# Altium project cs_consolidated.PrjPcb (part 2 of 3)

## Sheet source_A.SchDoc
size 381 x 241 mm; SheetNumber: 4; SheetTotal: 6
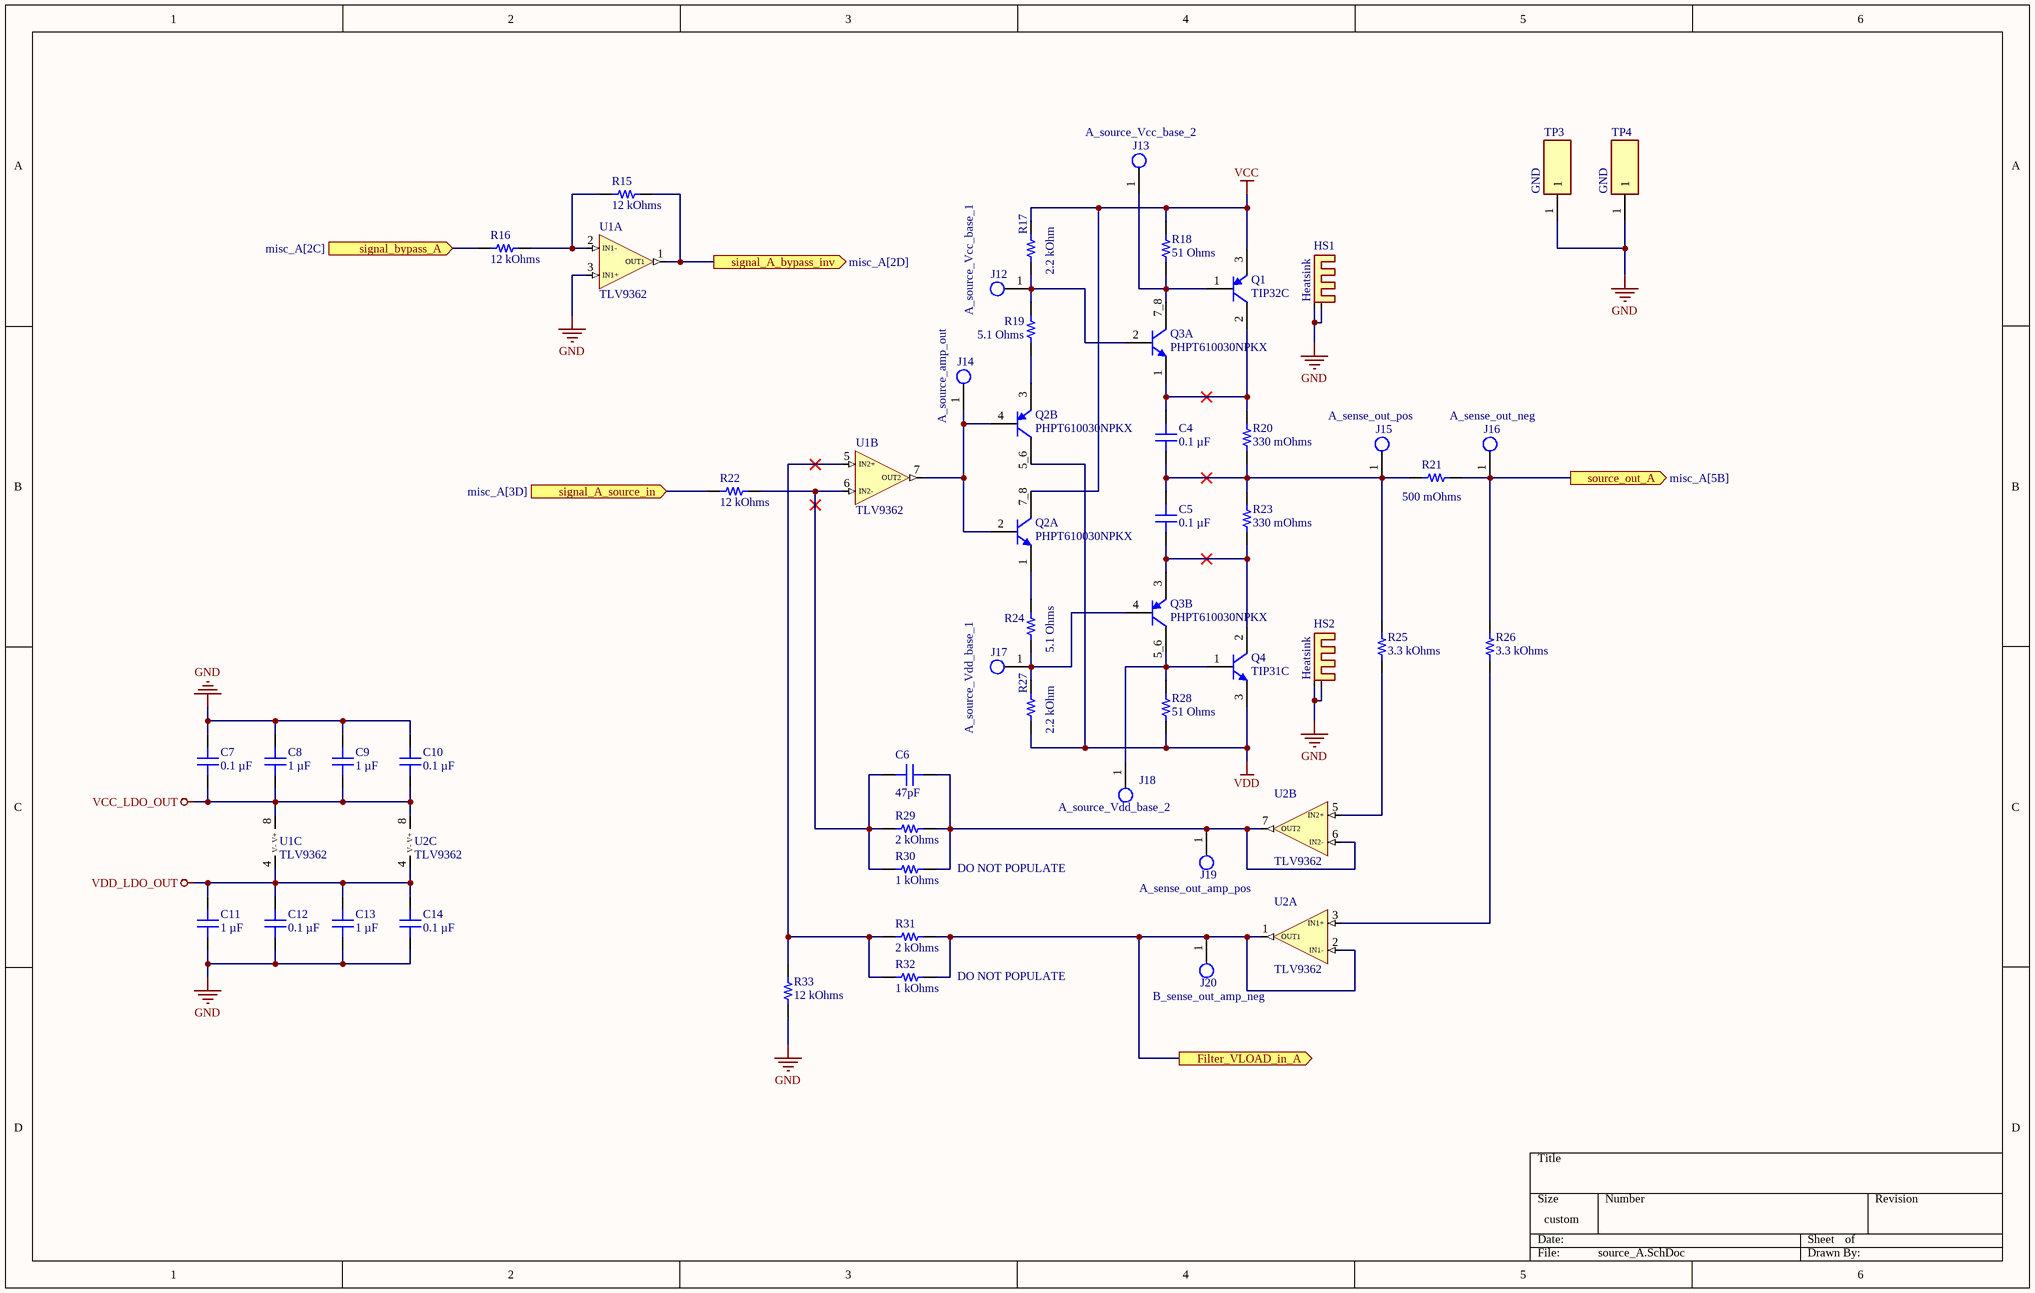
[diagram p3: source_A.SchDoc]

### Parts
C4  0.1 µF  [CAP 1206_3216 - 0.8MM]
C5  0.1 µF  [CAP 1206_3216 - 0.8MM]
C6  47pF  [CAP 1206_3216 - 1.8MM]
C7  0.1 µF  [CAP 1206_3216 - 0.8MM]
C8  1 µF  [CAP 1206_3216 - 0.8MM]
C9  1 µF  [CAP 1206_3216 - 0.8MM]
C10  0.1 µF  [CAP 1206_3216 - 0.8MM]
C11  1 µF  [CAP 1206_3216 - 0.8MM]
C12  0.1 µF  [CAP 1206_3216 - 0.8MM]
C13  1 µF  [CAP 1206_3216 - 0.8MM]
C14  0.1 µF  [CAP 1206_3216 - 0.8MM]
HS1  Heatsink  [593002B03400G]
HS2  Heatsink  [593002B03400G]
J12  A_source_Vcc_base_1  [FP-5001-MFG]
J13  A_source_Vcc_base_2  [FP-5001-MFG]
J14  A_source_amp_out  [FP-5001-MFG]
J15  A_sense_out_pos  [FP-5001-MFG]
J16  A_sense_out_neg  [FP-5001-MFG]
J17  A_source_Vdd_base_1  [FP-5001-MFG]
J18  A_source_Vdd_base_2  [FP-5001-MFG]
J19  A_sense_out_amp_pos  [FP-5001-MFG]
J20  B_sense_out_amp_neg  [FP-5001-MFG]
Q1  TIP32C  [ONSC-TO-220-3-221A-09]
Q2  PHPT610030NPKX  [TRANS_BUK9K18-40E,115]  (parts A,B of 2)
Q3  PHPT610030NPKX  [TRANS_BUK9K18-40E,115]  (parts A,B of 2)
Q4  TIP31C  [ONSC-TO-220-3-221A-09]
R15  12 kOhms  [RES 1206_3216]
R16  12 kOhms  [RES 1206_3216]
R17  2.2 kOhm  [RESC3116X65N]
R18  51 Ohms  [RES 1206_3216]
R19  5.1 Ohms  [RES 1206_3216]
R20  330 mOhms  [STACKPOLE CSR2512]
R21  500 mOhms  [STACKPOLE CSR2512]
R22  12 kOhms  [RES 1206_3216]
R23  330 mOhms  [STACKPOLE CSR2512]
R24  5.1 Ohms  [RES 1206_3216]
R25  3.3 kOhms  [YAGEO RES 1206_3216]
R26  3.3 kOhms  [YAGEO RES 1206_3216]
R27  2.2 kOhm  [RESC3116X65N]
R28  51 Ohms  [RES 1206_3216]
R29  2 kOhms  [RES 1206_3216]
R30  1 kOhms  [RES 1206_3216]
R31  2 kOhms  [RES 1206_3216]
R32  1 kOhms  [RES 1206_3216]
R33  12 kOhms  [RES 1206_3216]
TP3  GND  [S175146R]
TP4  GND  [S175146R]
U1  TLV9362  [SOIC8-127P600X175-8N]  (parts A,B,C of 3)
U2  TLV9362  [SOIC8-127P600X175-8N]  (parts A,B,C of 3)

### Ports
Filter_VLOAD_in_A (out), signal_A_bypass_inv (out, see misc_A[2D]), signal_A_source_in (in, see misc_A[3D]), signal_bypass_A (in, see misc_A[2C]), source_out_A (out, see misc_A[5B])

### Nets
GND: C7.1 C8.1 C9.2 C10.2 C11.2 C12.2 C13.2 C14.2 HS1.1 HS1.2 HS2.1 HS2.2 R33.1 TP3.1 TP4.1 U1.3(IN1+)
VCC: Q1.3(E) Q2.7_8(C1) R17.2 R18.2
VCC_LDO_OUT: C7.2 C8.2 C9.1 C10.1 U1.8(V+) U2.8(V+)
VDD: Q2.5_6(C2) Q4.3(E) R27.1 R28.1
VDD_LDO_OUT: C11.1 C12.1 C13.1 C14.1 U1.4(V-) U2.4(V-)
NetC4_1: C4.1 C5.2 J15.1 R20.1 R21.2 R23.2 R25.1
NetC4_2: C4.2 Q1.2(C) Q3.1(E1) R20.2
NetC5_1: C5.1 Q3.3(E2) Q4.2(C) R23.1
NetC6_1: C6.1 R22.1 R29.1 R30.1 U1.6(IN2-)
NetC6_2: C6.2 J19.1 R29.2 R30.2 U2.6(IN2-) U2.7(OUT2)
NetD1_2: J16.1 R21.1 R26.1 ; port source_out_A
NetD2_1: R16.2 ; port signal_bypass_A
NetJ10_1: R22.2 ; port signal_A_source_in
NetJ11_5: R15.2 U1.1(OUT1) ; port signal_A_bypass_inv
NetJ12_1: J12.1 Q3.2(B1) R17.1 R19.2
NetJ13_1: J13.1 Q1.1(B) Q3.7_8(C1) R18.1
NetJ14_1: J14.1 Q2.2(B1) Q2.4(B2) U1.7(OUT2)
NetJ17_1: J17.1 Q3.4(B2) R24.1 R27.2
NetJ18_1: J18.1 Q3.5_6(C2) Q4.1(B) R28.2
NetJ20_1: J20.1 R31.2 R32.2 U2.1(OUT1) U2.2(IN1-) ; port Filter_VLOAD_in_A
NetQ2_1: Q2.1(E1) R24.2
NetQ2_3: Q2.3(E2) R19.1
NetR15_1: R15.1 R16.1 U1.2(IN1-)
NetR25_2: R25.2 U2.5(IN2+)
NetR26_2: R26.2 U2.3(IN1+)
NetR31_1: R31.1 R32.1 R33.2 U1.5(IN2+)

### Notes on the sheet
- DO NOT POPULATE

### Library data of the parts
C4 C5 C7 C10 C12 C14 = 885012208087: CAP CER 0.1UF 50V X7R 1206; manufacturer: Würth Elektronik; Tolerance: ±10%; Part Number: 885012208087; Capacitance: 0.1 µF; Applications: General Purpose; componentlink1description: Datasheet; componentlink1url: https://katalog.we-online.de/pbs/datasheet/885012208087.pdf; componentlink2description: DigiKey Link; componentlink2url: https://www.digikey.com/en/products/detail/würth-elektronik/885012208087/5453982; Device Package: 1206 (3216 Metric); lastupdated: 6/4/2024 19:10:27; Lifecycle Status: Active; Minimum Order: 1; Mounting Type: Surface Mount, MLCC; Operating Temperature: -55°C ~ 125°C; Package / Case: 1206 (3216 Metric); packaging: TapeAndReel; partid: 20879; Part Status: Active; price: 0.06; series: WCAP-CSGP; Size / Dimension: 0.126" L x 0.063" W (3.20mm x 1.60mm); Supplier 1: DigiKey; Supplier Part Number 1: 732-8127-1-ND; Temperature Coefficient: X7R; Thickness (Max): 0.035" (0.90mm); value: 0.1 µF; Voltage - Rated: 50V
C6 = 1206AA470KAT1A: CAP CER 47PF 1KV C0G/NP0 1206; manufacturer: AVX Corporation; Temperature Coefficient: C0G, NP0; Tolerance: ±10%; Voltage - Rated: 1000V (1kV); Part Number: 1206AA470KAT1A; Capacitance: 47pF; Applications: General Purpose; componentlink1description: Datasheet; componentlink1url: http://datasheets.avx.com/AVX-HV_MLCC.pdf; componentlink2description: DigiKey Link; componentlink2url: http://digikey.com/product-detail/en/avx-corporation/1206AA470KAT1A/478-2949-1-ND/808148; Device Package: 1206 (3216 Metric); Features: High Voltage; lastupdated: 9/2/2020 01:05:31; Lifecycle Status: Active; Minimum Order: 1; Mounting Type: Surface Mount, MLCC; Operating Temperature: -55°C ~ 125°C; Package / Case: 1206 (3216 Metric); packaging: TapeAndReel; partid: 21825; Part Status: Active; price: 0.11; series: -; Size / Dimension: 0.130" L x 0.063" W (3.30mm x 1.60mm); Supplier 1: DigiKey; Supplier Part Number 1: 478-2949-1-ND; Thickness (Max): 0.071" (1.80mm); value: 47pF
C8 C9 C11 C13 = 885012208093: CAP CER 1UF 50V X7R 1206; manufacturer: Würth Elektronik; Tolerance: ±10%; Part Number: 885012208093; Capacitance: 1 µF; Applications: General Purpose; componentlink1description: Datasheet; componentlink1url: https://katalog.we-online.de/pbs/datasheet/885012208093.pdf; componentlink2description: DigiKey Link; componentlink2url: https://www.digikey.com/en/products/detail/würth-elektronik/885012208093/5453432; Device Package: 1206 (3216 Metric); lastupdated: 6/4/2024 19:10:33; Lifecycle Status: Active; Minimum Order: 1; Mounting Type: Surface Mount, MLCC; Operating Temperature: -55°C ~ 125°C; Package / Case: 1206 (3216 Metric); packaging: TapeAndReel; partid: 39665; Part Status: Active; price: 0.10; series: WCAP-CSGP; Size / Dimension: 0.126" L x 0.063" W (3.20mm x 1.60mm); Supplier 1: DigiKey; Supplier Part Number 1: 732-7577-1-ND; Temperature Coefficient: X7R; Thickness (Max): 0.075" (1.90mm); value: 1 µF; Voltage - Rated: 50V
HS1 HS2 = 593002B03400G: 593002B03400G Heatsink TO220 13.4 C/W; Manufacturer_Name: Aavid Thermalloy; Datasheet Link: 3dofAavidThermalloy593002B03400G; Height: 29.97mm; Manufacturer_Part_Number: 593002B03400G; Mouser Part Number: 532-593002B03400G; Mouser Price/Stock: https://www.mouser.co.uk/ProductDetail/Aavid/593002B03400G?qs=W5RTpZXIxnNcIJ9LzCiOiQ%3D%3D; Arrow Part Number: 593002B03400G; Arrow Price/Stock: https://www.arrow.com/en/products/593002b03400g/aavid-thermalloy
J12-J20 = 5001: PC TEST POINT MINIATURE BLACK; Body Material: Bronze; Plating: Silver; Inside Diameter: 1.27mm; Hole Diameter: 1.6mm; Number of Ports: 1; Outside Diameter: 2.54mm; Insulation: Insulated; Insulation Material: Nylon; Mount: Through Hole; RoHS Compliant: Yes; Series: THM; Height: 0.3inch; Termination: Through Hole; Material: Nylon; Packaging: Bulk; Contact Material: Bronze; REACH SVHC: No SVHC; Contact Plating: Silver; Orientation: Straight; Lead Free: Lead Free; Package Quantity: 100; Length: 7.62mm; Flammability Rating: UL94 V-0; Number of Contacts: 1; Diameter: 2.54mm; Housing Color: Black; Color: Black; Supplier 1: Mouser; Supplier Part Number 1: 534-5001
Q1 = TIP32C: Complementary Silicon Plastic Power Transistor, 3-Pin TO-220, Tube; Manufacturer: On Semiconductor; fT Min (MHz): 3; Polarity: PNP; DatasheetVersion: Rev. 14; PackageVersion: Rev. AG, 09/2011; PackageReference: TO-220-3-221A-09; PackageDescription: 3-Pin Flange Mount, Vertical Straight Lead, Body 9.97 x 4.445 mm, Pitch 2.54 mm; Supplier 1: Digi-Key; Supplier Part Number 1: TIP32COS-ND; IC Continuous (A): 3; Packing: Tube; RoHS: FALSE; Mounting Technology: Through Hole; PartNumber: TIP32C; ComponentLink1Description: Manufacturer URL; ComponentLink1URL: http://www.onsemi.com/; ComponentLink2Description: Datasheet; ComponentLink2URL: http://www.onsemi.com/pub_link/Collateral/TIP31A-D.PDF; ComponentLink3Description: Package Specification; ComponentLink3URL: http://www.onsemi.com/pub_link/Collateral/221A-09.PDF
Q2 Q3 = PHPT610030NPK: ComponentLink1Description: Datasheet; ComponentLink1URL: https://assets.nexperia.com/documents/data-sheet/PHPT610030NPK.pdf; ComponentLink2Description: Supplier; ComponentLink2URL: https://hr.mouser.com/ProductDetail/Nexperia/PHPT610030NPKX?qs=%252BRKXB2WKlSeoXKhT5DAScw%3D%3D
Q4 = TIP31C: Complementary Silicon Plastic Power Transistor, 3-Pin TO-220, Tube; Manufacturer: On Semiconductor; fT Min (MHz): 3; Polarity: NPN; DatasheetVersion: Rev. 14; PackageVersion: Rev. AG, 09/2011; PackageReference: TO-220-3-221A-09; PackageDescription: 3-Pin Flange Mount, Vertical Straight Lead, Body 9.97 x 4.445 mm, Pitch 2.54 mm; Supplier 1: Digi-Key; Supplier Part Number 1: TIP31COS-ND; IC Continuous (A): 3; Packing: Tube; RoHS: FALSE; Mounting Technology: Through Hole; PartNumber: TIP31C; ComponentLink1Description: Manufacturer URL; ComponentLink1URL: http://www.onsemi.com/; ComponentLink2Description: Datasheet; ComponentLink2URL: http://www.onsemi.com/pub_link/Collateral/TIP31A-D.PDF; ComponentLink3Description: Package Specification; ComponentLink3URL: http://www.onsemi.com/pub_link/Collateral/221A-09.PDF
R15 R16 R22 R33 = ERA-8AEB123V: RES SMD 12K OHM 0.1% 1/4W 1206; Manufacturer: Panasonic Electronic Components; Power (Watts): 0.25W, 1/4W; Temperature Coefficient: ±25ppm/°C; Part Number: ERA-8AEB123V; ComponentLink1Description: Datasheet; ComponentLink1URL: https://industrial.panasonic.com/cdbs/www-data/pdf/RDM0000/AOA0000C307.pdf; ComponentLink2Description: DigiKey Link; ComponentLink2URL: https://www.digikey.com/en/products/detail/panasonic-electronic-components/ERA-8AEB123V/3070775; Composition: Thin Film; Device Package: 1206 (3216 Metric); Height - Seated (Max): 0.028" (0.70mm); LastUpdated: 2/9/2024 20:53:53; Lifecycle Status: Active; Minimum Order: 1; Number of Terminations: 2; Operating Temperature: -55°C ~ 155°C; Package / Case: 1206 (3216 Metric); Packaging: TapeAndReel; PartId: 40988; Part Status: Active; Price: 0.10; Resistance: 12 kOhms; Series: ERA-8A; Size / Dimension: 0.126" L x 0.063" W (3.20mm x 1.60mm); Supplier 1: DigiKey; Supplier Part Number 1: 10-ERA-8AEB123VCT-ND; Supplier Device Package: 1206; Tolerance: ±0.1%; Value: 12 kOhms; Features: Automotive AEC-Q200; Ratings: AEC-Q200
R17 R27 = RT1206FRE072K2L: Resistor; Manufacturer_Name: YAGEO; Datasheet Link: https://www.mouser.com/datasheet/2/447/PYu_RT_1_to_0_01_RoHS_L_12-3003070.pdf; Height: 0.65mm; Manufacturer_Part_Number: RT1206FRE072K2L; Mouser Part Number: 603-RT1206FRE072K2L; Mouser Price/Stock: https://www.mouser.co.uk/ProductDetail/YAGEO/RT1206FRE072K2L?qs=yNCrj0CQcyJif6VASMbdeQ%3D%3D; Arrow Part Number: RT1206FRE072K2L; Arrow Price/Stock: https://www.arrow.com/en/products/rt1206fre072k2l/yageo?utm_currency=USD&region=nac
R18 R28 = ERJ-8GEYJ510V: RES SMD 51 OHM 5% 1/4W 1206; Manufacturer: Panasonic Electronic Components; Power (Watts): 0.25W, 1/4W; Temperature Coefficient: ±200ppm/°C; Part Number: ERJ-8GEYJ510V; ComponentLink1Description: Datasheet; ComponentLink1URL: http://industrial.panasonic.com/www-cgi/jvcr13pz.cgi?E+PZ+3+AOA0001+ERJ8GEYJ510V+7+WW; ComponentLink2Description: DigiKey Link; ComponentLink2URL: https://www.digikey.com/en/products/detail/panasonic-electronic-components/ERJ-8GEYJ510V/11678; Composition: Thick Film; Device Package: 1206 (3216 Metric); Features: Automotive AEC-Q200; Height - Seated (Max): 0.028" (0.70mm); LastUpdated: 2/9/2024 20:54:16; Lifecycle Status: Active; Minimum Order: 1; Number of Terminations: 2; Operating Temperature: -55°C ~ 155°C; Package / Case: 1206 (3216 Metric); Packaging: TapeAndReel; PartId: 34147; Part Status: Active; Price: 0.02; Ratings: AEC-Q200; Resistance: 51 Ohms; Series: ERJ-8G; Size / Dimension: 0.126" L x 0.063" W (3.20mm x 1.60mm); Supplier 1: DigiKey; Supplier Part Number 1: P51ECT-ND; Supplier Device Package: 1206; Tolerance: ±5%; Value: 51 Ohms
R19 R24 = ERJ-8GEYJ5R1V: RES SMD 5.1 OHM 5% 1/4W 1206; Manufacturer: Panasonic Electronic Components; Power (Watts): 0.25W, 1/4W; Temperature Coefficient: -100/ +600ppm/°C; Part Number: ERJ-8GEYJ5R1V; ComponentLink1Description: Datasheet; ComponentLink1URL: http://industrial.panasonic.com/www-cgi/jvcr13pz.cgi?E+PZ+3+AOA0001+ERJ8GEYJ5R1V+7+WW; ComponentLink2Description: DigiKey Link; ComponentLink2URL: https://www.digikey.com/en/products/detail/panasonic-electronic-components/ERJ-8GEYJ5R1V/282211; Composition: Thick Film; Device Package: 1206 (3216 Metric); Features: Automotive AEC-Q200; Height - Seated (Max): 0.028" (0.70mm); LastUpdated: 2/9/2024 20:54:09; Lifecycle Status: Active; Minimum Order: 1; Number of Terminations: 2; Operating Temperature: -55°C ~ 155°C; Package / Case: 1206 (3216 Metric); Packaging: TapeAndReel; PartId: 36042; Part Status: Active; Price: 0.02; Ratings: AEC-Q200; Resistance: 5.1 Ohms; Series: ERJ-8G; Size / Dimension: 0.126" L x 0.063" W (3.20mm x 1.60mm); Supplier 1: DigiKey; Supplier Part Number 1: P5.1ECT-ND; Supplier Device Package: 1206; Tolerance: ±5%; Value: 5.1 Ohms
R20 R23 = CSRN2512FKR330: RES 0.33 OHM 1% 2W 2512; Manufacturer: Stackpole Electronics Inc; Temperature Coefficient: ±200ppm/°C; Part Number: CSRN2512FKR330; Package / Case: 2512 (6432 Metric); ComponentLink1Description: Datasheet; ComponentLink1URL: https://www.seielect.com/catalog/sei-csr_csrn.pdf; ComponentLink2Description: DigiKey Link; ComponentLink2URL: https://www.digikey.com/en/products/detail/stackpole-electronics-inc/CSRN2512FKR330/1742756; Composition: Thick Film; Device Package: 2512 (6432 Metric); Features: Current Sense; Height - Seated (Max): 0.028" (0.70mm); LastUpdated: 2/17/2022 18:43:57; Lifecycle Status: Active; Minimum Order: 1; Number of Terminations: 2; Operating Temperature: -55°C ~ 155°C; Packaging: TapeAndReel; PartId: 1770; Part Status: Active; Power (Watts): 2W; Price: 0.12; Resistance: 330 mOhms; Series: CSRN; Size / Dimension: 0.250" L x 0.124" W (6.35mm x 3.15mm); Supplier 1: DigiKey; Supplier Part Number 1: CSRN2512FKR330CT-ND; Supplier Device Package: 2512; Tolerance: ±1%; Value: 330 mOhms
R21 = CSRN2512FKR500: RES 0.5 OHM 1% 2W 2512; Manufacturer: Stackpole Electronics Inc; Temperature Coefficient: ±200ppm/°C; Part Number: CSRN2512FKR500; Package / Case: 2512 (6432 Metric); ComponentLink1Description: Datasheet; ComponentLink1URL: https://www.seielect.com/catalog/sei-csr_csrn.pdf; ComponentLink2Description: DigiKey Link; ComponentLink2URL: https://www.digikey.com/en/products/detail/stackpole-electronics-inc/CSRN2512FKR500/1742768; Composition: Thick Film; Device Package: 2512 (6432 Metric); Features: Current Sense; Height - Seated (Max): 0.028" (0.70mm); LastUpdated: 2/17/2022 18:43:58; Lifecycle Status: Active; Minimum Order: 1; Number of Terminations: 2; Operating Temperature: -55°C ~ 155°C; Packaging: TapeAndReel; PartId: 1683; Part Status: Active; Power (Watts): 2W; Price: 0.07; Resistance: 500 mOhms; Series: CSRN; Size / Dimension: 0.250" L x 0.124" W (6.35mm x 3.15mm); Supplier 1: DigiKey; Supplier Part Number 1: CSRN2512FKR500CT-ND; Supplier Device Package: 2512; Tolerance: ±1%; Value: 500 mOhms
R25 R26 = RT1206FRE073K3L: RES SMD 3.3K OHM 1% 1/4W 1206; Manufacturer: Yageo; Power (Watts): 0.25W, 1/4W; Temperature Coefficient: ±50ppm/°C; Part Number: RT1206FRE073K3L; ComponentLink1Description: Datasheet; ComponentLink1URL: https://www.yageo.com/upload/media/product/productsearch/datasheet/rchip/PYu-RT_1-to-0.01_RoHS_L_12.pdf; ComponentLink2Description: DigiKey Link; ComponentLink2URL: https://www.digikey.com/en/products/detail/yageo/RT1206FRE073K3L/1083187; Composition: Thin Film; Device Package: 1206 (3216 Metric); Height - Seated (Max): 0.026" (0.65mm); LastUpdated: 7/25/2024 09:21:22; Lifecycle Status: Active; Minimum Order: 1; Number of Terminations: 2; Operating Temperature: -55°C ~ 155°C; Package / Case: 1206 (3216 Metric); Packaging: TapeAndReel; PartId: 58380; Part Status: Active; Price: 0.01; Resistance: 3.3 kOhms; Series: RT; Size / Dimension: 0.122" L x 0.063" W (3.10mm x 1.60mm); Supplier 1: DigiKey; Supplier Part Number 1: 13-RT1206FRE073K3LCT-ND; Supplier Device Package: 1206; Tolerance: ±1%; Value: 3.3 kOhms
R29 R31 = ERA-8AEB202V: RES SMD 2K OHM 0.1% 1/4W 1206; Manufacturer: Panasonic Electronic Components; Power (Watts): 0.25W, 1/4W; Temperature Coefficient: ±25ppm/°C; Part Number: ERA-8AEB202V; ComponentLink1Description: Datasheet; ComponentLink1URL: https://industrial.panasonic.com/cdbs/www-data/pdf/RDM0000/AOA0000C307.pdf; ComponentLink2Description: DigiKey Link; ComponentLink2URL: https://www.digikey.com/en/products/detail/panasonic-electronic-components/ERA-8AEB202V/3070866; Composition: Thin Film; Device Package: 1206 (3216 Metric); Features: Automotive AEC-Q200; Height - Seated (Max): 0.028" (0.70mm); LastUpdated: 2/9/2024 20:54:17; Lifecycle Status: Active; Minimum Order: 1; Number of Terminations: 2; Operating Temperature: -55°C ~ 155°C; Package / Case: 1206 (3216 Metric); Packaging: TapeAndReel; PartId: 34011; Part Status: Active; Price: 0.10; Ratings: AEC-Q200; Resistance: 2 kOhms; Series: ERA-8A; Size / Dimension: 0.126" L x 0.063" W (3.20mm x 1.60mm); Supplier 1: DigiKey; Supplier Part Number 1: P2.0KBCCT-ND; Supplier Device Package: 1206; Tolerance: ±0.1%; Value: 2 kOhms
R30 R32 = ERA-8AEB102V: RES SMD 1K OHM 0.1% 1/4W 1206; Manufacturer: Panasonic Electronic Components; Power (Watts): 0.25W, 1/4W; Temperature Coefficient: ±25ppm/°C; Part Number: ERA-8AEB102V; ComponentLink1Description: Datasheet; ComponentLink1URL: https://industrial.panasonic.com/cdbs/www-data/pdf/RDM0000/AOA0000C307.pdf; ComponentLink2Description: DigiKey Link; ComponentLink2URL: https://www.digikey.com/en/products/detail/panasonic-electronic-components/ERA-8AEB102V/3070741; Composition: Thin Film; Device Package: 1206 (3216 Metric); Features: Automotive AEC-Q200; Height - Seated (Max): 0.028" (0.70mm); LastUpdated: 2/9/2024 20:54:17; Lifecycle Status: Active; Minimum Order: 1; Number of Terminations: 2; Operating Temperature: -55°C ~ 155°C; Package / Case: 1206 (3216 Metric); Packaging: TapeAndReel; PartId: 33986; Part Status: Active; Price: 0.10; Ratings: AEC-Q200; Resistance: 1 kOhms; Series: ERA-8A; Size / Dimension: 0.126" L x 0.063" W (3.20mm x 1.60mm); Supplier 1: DigiKey; Supplier Part Number 1: P1.0KBCCT-ND; Supplier Device Package: 1206; Tolerance: ±0.1%; Value: 1 kOhms
TP3 TP4 = S1751-46R: Test Point; Manufacturer_Name: Harwin; Datasheet Link: https://cdn.harwin.com/pdfs/S1751R.pdf; Height: 2mm; Manufacturer_Part_Number: S1751-46R; Mouser Part Number: 855-S1751-46R; Mouser Price/Stock: https://www.mouser.co.uk/ProductDetail/Harwin/S1751-46R?qs=l6ZPVqNVZb71wETAKrfRig%3D%3D
U1 U2 = TLV9362: TLV936x 10-MHz, 40-V, RRO, Operational Amplifie; ComponentLink1Description: Datasheet; ComponentLink1URL: https://www.ti.com/lit/ds/symlink/tlv9362.pdf

## Sheet source_B.SchDoc
size 381 x 241 mm; SheetNumber: 5; SheetTotal: 6
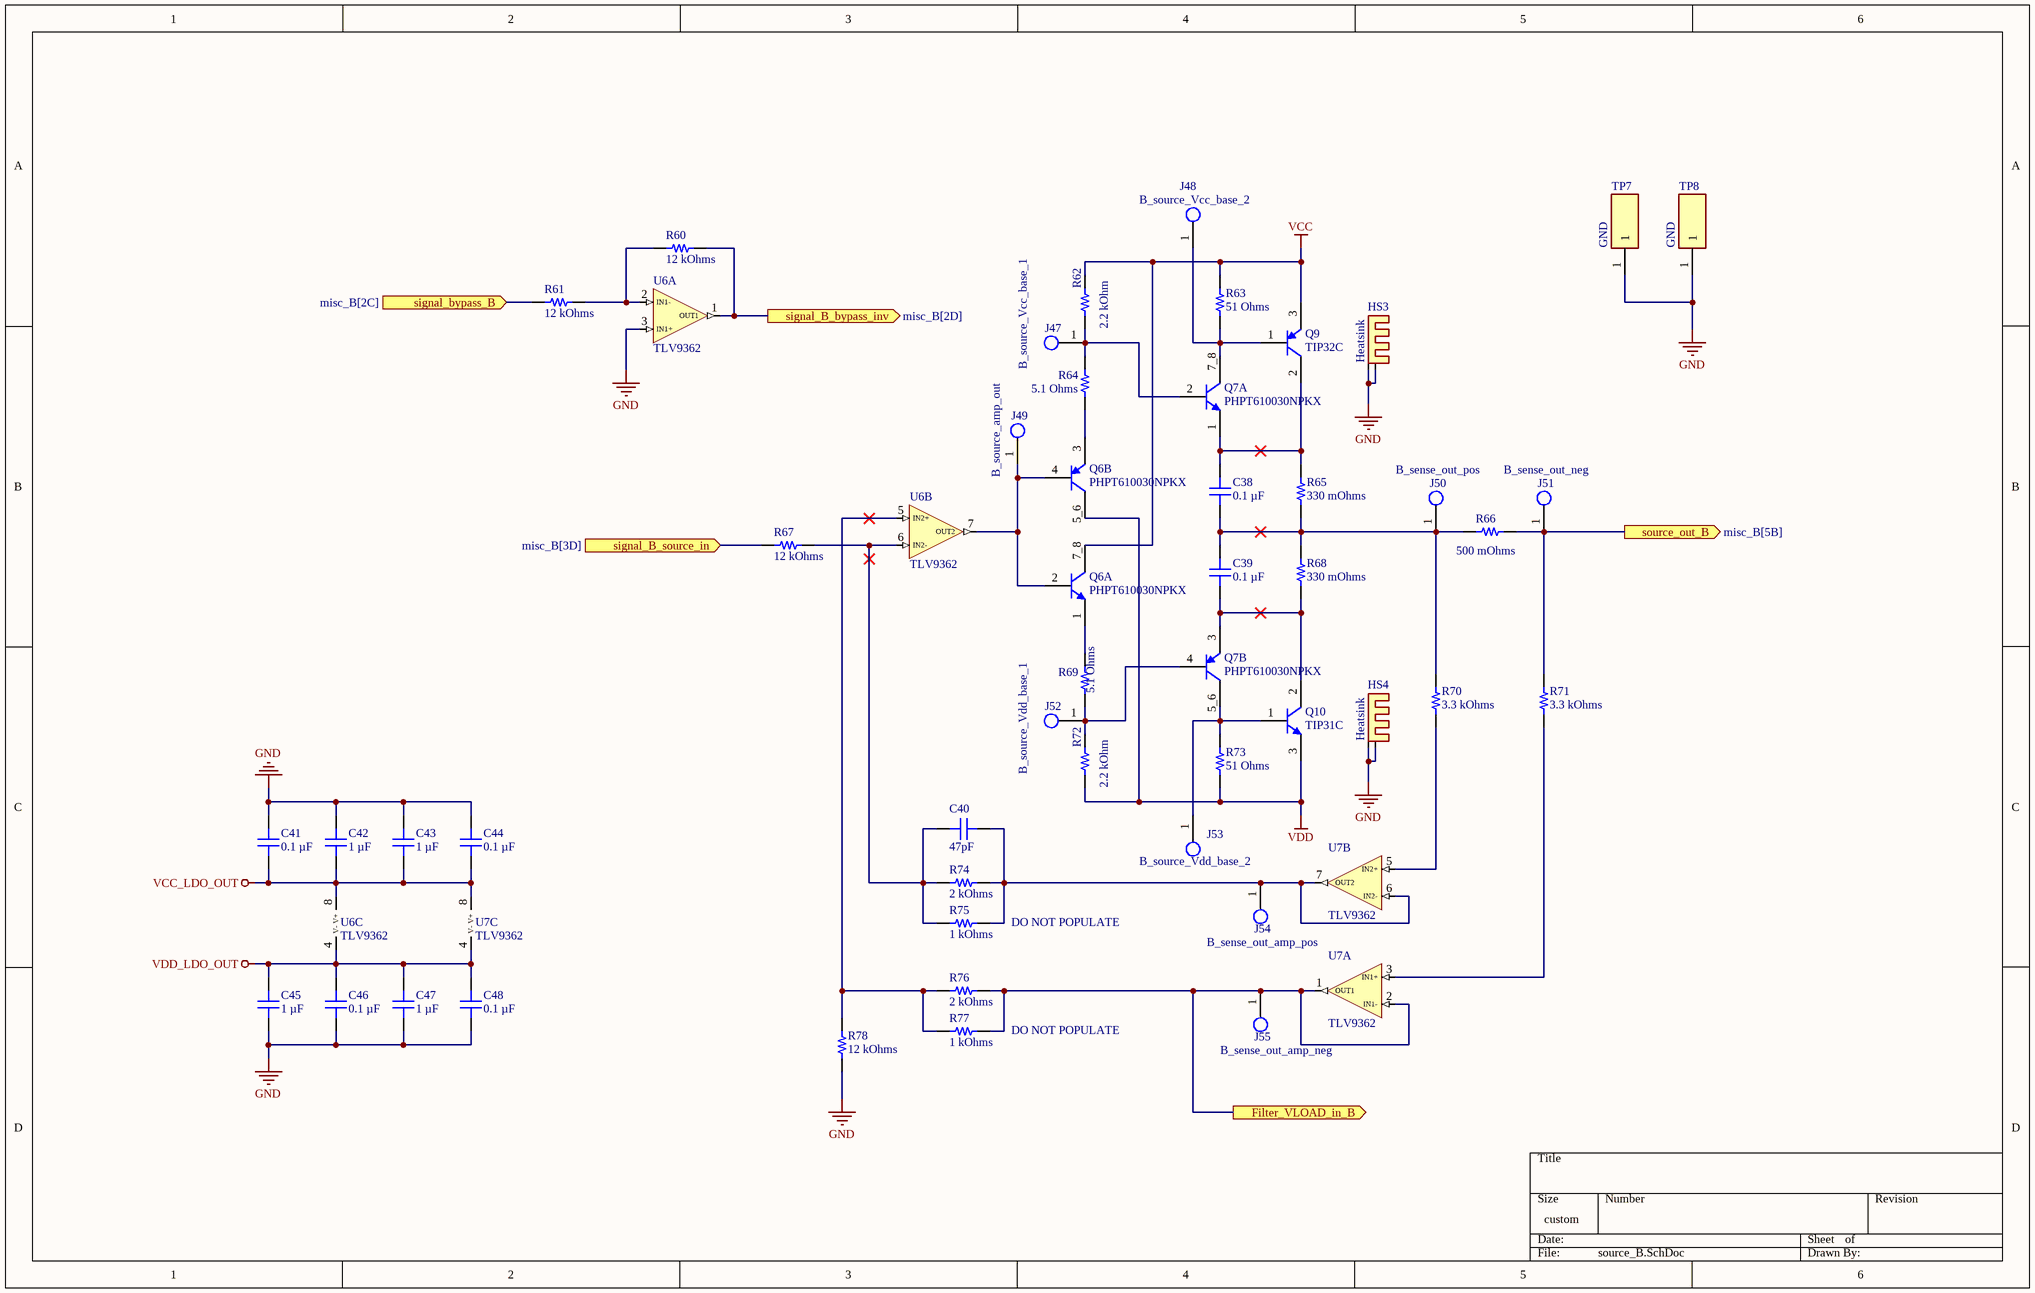
[diagram p4: source_B.SchDoc]

### Parts
C38  0.1 µF  [CAP 1206_3216 - 0.8MM]
C39  0.1 µF  [CAP 1206_3216 - 0.8MM]
C40  47pF  [CAP 1206_3216 - 1.8MM]
C41  0.1 µF  [CAP 1206_3216 - 0.8MM]
C42  1 µF  [CAP 1206_3216 - 0.8MM]
C43  1 µF  [CAP 1206_3216 - 0.8MM]
C44  0.1 µF  [CAP 1206_3216 - 0.8MM]
C45  1 µF  [CAP 1206_3216 - 0.8MM]
C46  0.1 µF  [CAP 1206_3216 - 0.8MM]
C47  1 µF  [CAP 1206_3216 - 0.8MM]
C48  0.1 µF  [CAP 1206_3216 - 0.8MM]
HS3  Heatsink  [593002B03400G]
HS4  Heatsink  [593002B03400G]
J47  B_source_Vcc_base_1  [FP-5001-MFG]
J48  B_source_Vcc_base_2  [FP-5001-MFG]
J49  B_source_amp_out  [FP-5001-MFG]
J50  B_sense_out_pos  [FP-5001-MFG]
J51  B_sense_out_neg  [FP-5001-MFG]
J52  B_source_Vdd_base_1  [FP-5001-MFG]
J53  B_source_Vdd_base_2  [FP-5001-MFG]
J54  B_sense_out_amp_pos  [FP-5001-MFG]
J55  B_sense_out_amp_neg  [FP-5001-MFG]
Q6  PHPT610030NPKX  [TRANS_BUK9K18-40E,115]  (parts A,B of 2)
Q7  PHPT610030NPKX  [TRANS_BUK9K18-40E,115]  (parts A,B of 2)
Q9  TIP32C  [ONSC-TO-220-3-221A-09]
Q10  TIP31C  [ONSC-TO-220-3-221A-09]
R60  12 kOhms  [RES 1206_3216]
R61  12 kOhms  [RES 1206_3216]
R62  2.2 kOhm  [RESC3116X65N]
R63  51 Ohms  [RES 1206_3216]
R64  5.1 Ohms  [RES 1206_3216]
R65  330 mOhms  [STACKPOLE CSR2512]
R66  500 mOhms  [STACKPOLE CSR2512]
R67  12 kOhms  [RES 1206_3216]
R68  330 mOhms  [STACKPOLE CSR2512]
R69  5.1 Ohms  [RES 1206_3216]
R70  3.3 kOhms  [YAGEO RES 1206_3216]
R71  3.3 kOhms  [YAGEO RES 1206_3216]
R72  2.2 kOhm  [RESC3116X65N]
R73  51 Ohms  [RES 1206_3216]
R74  2 kOhms  [RES 1206_3216]
R75  1 kOhms  [RES 1206_3216]
R76  2 kOhms  [RES 1206_3216]
R77  1 kOhms  [RES 1206_3216]
R78  12 kOhms  [RES 1206_3216]
TP7  GND  [S175146R]
TP8  GND  [S175146R]
U6  TLV9362  [SOIC8-127P600X175-8N]  (parts A,B,C of 3)
U7  TLV9362  [SOIC8-127P600X175-8N]  (parts A,B,C of 3)

### Ports
Filter_VLOAD_in_B (out), signal_B_bypass_inv (out, see misc_B[2D]), signal_B_source_in (in, see misc_B[3D]), signal_bypass_B (in, see misc_B[2C]), source_out_B (out, see misc_B[5B])

### Nets
GND: C41.1 C42.1 C43.2 C44.2 C45.2 C46.2 C47.2 C48.2 HS3.1 HS3.2 HS4.1 HS4.2 R78.1 TP7.1 TP8.1 U6.3(IN1+)
VCC: Q6.7_8(C1) Q9.3(E) R62.2 R63.2
VCC_LDO_OUT: C41.2 C42.2 C43.1 C44.1 U6.8(V+) U7.8(V+)
VDD: Q6.5_6(C2) Q10.3(E) R72.1 R73.1
VDD_LDO_OUT: C45.1 C46.1 C47.1 C48.1 U6.4(V-) U7.4(V-)
NetC38_1: C38.1 C39.2 J50.1 R65.1 R66.2 R68.2 R70.1
NetC38_2: C38.2 Q7.1(E1) Q9.2(C) R65.2
NetC39_1: C39.1 Q7.3(E2) Q10.2(C) R68.1
NetC40_1: C40.1 R67.1 R74.1 R75.1 U6.6(IN2-)
NetC40_2: C40.2 J54.1 R74.2 R75.2 U7.6(IN2-) U7.7(OUT2)
NetD5_2: J51.1 R66.1 R71.1 ; port source_out_B
NetD6_1: R61.2 ; port signal_bypass_B
NetJ45_1: R67.2 ; port signal_B_source_in
NetJ46_5: R60.2 U6.1(OUT1) ; port signal_B_bypass_inv
NetJ47_1: J47.1 Q7.2(B1) R62.1 R64.2
NetJ48_1: J48.1 Q7.7_8(C1) Q9.1(B) R63.1
NetJ49_1: J49.1 Q6.2(B1) Q6.4(B2) U6.7(OUT2)
NetJ52_1: J52.1 Q7.4(B2) R69.1 R72.2
NetJ53_1: J53.1 Q7.5_6(C2) Q10.1(B) R73.2
NetJ55_1: J55.1 R76.2 R77.2 U7.1(OUT1) U7.2(IN1-) ; port Filter_VLOAD_in_B
NetQ6_1: Q6.1(E1) R69.2
NetQ6_3: Q6.3(E2) R64.1
NetR60_1: R60.1 R61.1 U6.2(IN1-)
NetR70_2: R70.2 U7.5(IN2+)
NetR71_2: R71.2 U7.3(IN1+)
NetR76_1: R76.1 R77.1 R78.2 U6.5(IN2+)

### Notes on the sheet
- DO NOT POPULATE

### Library data of the parts
C38 C39 C41 C44 C46 C48 = 885012208087: as C4 on sheet source_A; Part Number: 885012208087; Capacitance: 0.1 µF; Applications: General Purpose; componentlink1description: Datasheet; componentlink1url: https://katalog.we-online.de/pbs/datasheet/885012208087.pdf; componentlink2description: DigiKey Link; componentlink2url: https://www.digikey.com/en/products/detail/würth-elektronik/885012208087/5453982; Device Package: 1206 (3216 Metric); lastupdated: 6/4/2024 19:10:27; Lifecycle Status: Active; Minimum Order: 1; Mounting Type: Surface Mount, MLCC; Operating Temperature: -55°C ~ 125°C; Package / Case: 1206 (3216 Metric); packaging: TapeAndReel; partid: 20879; Part Status: Active; price: 0.06; series: WCAP-CSGP; Size / Dimension: 0.126" L x 0.063" W (3.20mm x 1.60mm); Supplier 1: DigiKey; Supplier Part Number 1: 732-8127-1-ND; Temperature Coefficient: X7R; Thickness (Max): 0.035" (0.90mm); value: 0.1 µF; Voltage - Rated: 50V
C40 = 1206AA470KAT1A: as C6 on sheet source_A; Part Number: 1206AA470KAT1A; Capacitance: 47pF; Applications: General Purpose; componentlink1description: Datasheet; componentlink1url: http://datasheets.avx.com/AVX-HV_MLCC.pdf; componentlink2description: DigiKey Link; componentlink2url: http://digikey.com/product-detail/en/avx-corporation/1206AA470KAT1A/478-2949-1-ND/808148; Device Package: 1206 (3216 Metric); Features: High Voltage; lastupdated: 9/2/2020 01:05:31; Lifecycle Status: Active; Minimum Order: 1; Mounting Type: Surface Mount, MLCC; Operating Temperature: -55°C ~ 125°C; Package / Case: 1206 (3216 Metric); packaging: TapeAndReel; partid: 21825; Part Status: Active; price: 0.11; series: -; Size / Dimension: 0.130" L x 0.063" W (3.30mm x 1.60mm); Supplier 1: DigiKey; Supplier Part Number 1: 478-2949-1-ND; Thickness (Max): 0.071" (1.80mm); value: 47pF
C42 C43 C45 C47 = 885012208093: as C8 on sheet source_A; Part Number: 885012208093; Capacitance: 1 µF; Applications: General Purpose; componentlink1description: Datasheet; componentlink1url: https://katalog.we-online.de/pbs/datasheet/885012208093.pdf; componentlink2description: DigiKey Link; componentlink2url: https://www.digikey.com/en/products/detail/würth-elektronik/885012208093/5453432; Device Package: 1206 (3216 Metric); lastupdated: 6/4/2024 19:10:33; Lifecycle Status: Active; Minimum Order: 1; Mounting Type: Surface Mount, MLCC; Operating Temperature: -55°C ~ 125°C; Package / Case: 1206 (3216 Metric); packaging: TapeAndReel; partid: 39665; Part Status: Active; price: 0.10; series: WCAP-CSGP; Size / Dimension: 0.126" L x 0.063" W (3.20mm x 1.60mm); Supplier 1: DigiKey; Supplier Part Number 1: 732-7577-1-ND; Temperature Coefficient: X7R; Thickness (Max): 0.075" (1.90mm); value: 1 µF; Voltage - Rated: 50V
HS3 HS4 = 593002B03400G: as HS1 on sheet source_A; Datasheet Link: 3dofAavidThermalloy593002B03400G; Height: 29.97mm; Manufacturer_Part_Number: 593002B03400G; Mouser Part Number: 532-593002B03400G; Mouser Price/Stock: https://www.mouser.co.uk/ProductDetail/Aavid/593002B03400G?qs=W5RTpZXIxnNcIJ9LzCiOiQ%3D%3D; Arrow Part Number: 593002B03400G; Arrow Price/Stock: https://www.arrow.com/en/products/593002b03400g/aavid-thermalloy
J47-J55 = 5001: as J12 on sheet source_A; Insulation Material: Nylon; Mount: Through Hole; RoHS Compliant: Yes; Series: THM; Height: 0.3inch; Termination: Through Hole; Material: Nylon; Packaging: Bulk; Contact Material: Bronze; REACH SVHC: No SVHC; Contact Plating: Silver; Orientation: Straight; Lead Free: Lead Free; Package Quantity: 100; Length: 7.62mm; Flammability Rating: UL94 V-0; Number of Contacts: 1; Diameter: 2.54mm; Housing Color: Black; Color: Black; Supplier 1: Mouser; Supplier Part Number 1: 534-5001
Q9 = TIP32C: as Q1 on sheet source_A; DatasheetVersion: Rev. 14; PackageVersion: Rev. AG, 09/2011; PackageReference: TO-220-3-221A-09; PackageDescription: 3-Pin Flange Mount, Vertical Straight Lead, Body 9.97 x 4.445 mm, Pitch 2.54 mm; Supplier 1: Digi-Key; Supplier Part Number 1: TIP32COS-ND; IC Continuous (A): 3; Packing: Tube; RoHS: FALSE; Mounting Technology: Through Hole; PartNumber: TIP32C; ComponentLink1Description: Manufacturer URL; ComponentLink1URL: http://www.onsemi.com/; ComponentLink2Description: Datasheet; ComponentLink2URL: http://www.onsemi.com/pub_link/Collateral/TIP31A-D.PDF; ComponentLink3Description: Package Specification; ComponentLink3URL: http://www.onsemi.com/pub_link/Collateral/221A-09.PDF
Q10 = TIP31C: as Q4 on sheet source_A; DatasheetVersion: Rev. 14; PackageVersion: Rev. AG, 09/2011; PackageReference: TO-220-3-221A-09; PackageDescription: 3-Pin Flange Mount, Vertical Straight Lead, Body 9.97 x 4.445 mm, Pitch 2.54 mm; Supplier 1: Digi-Key; Supplier Part Number 1: TIP31COS-ND; IC Continuous (A): 3; Packing: Tube; RoHS: FALSE; Mounting Technology: Through Hole; PartNumber: TIP31C; ComponentLink1Description: Manufacturer URL; ComponentLink1URL: http://www.onsemi.com/; ComponentLink2Description: Datasheet; ComponentLink2URL: http://www.onsemi.com/pub_link/Collateral/TIP31A-D.PDF; ComponentLink3Description: Package Specification; ComponentLink3URL: http://www.onsemi.com/pub_link/Collateral/221A-09.PDF
R60 R61 R67 R78 = ERA-8AEB123V: as R15 on sheet source_A; Part Number: ERA-8AEB123V; ComponentLink1Description: Datasheet; ComponentLink1URL: https://industrial.panasonic.com/cdbs/www-data/pdf/RDM0000/AOA0000C307.pdf; ComponentLink2Description: DigiKey Link; ComponentLink2URL: https://www.digikey.com/en/products/detail/panasonic-electronic-components/ERA-8AEB123V/3070775; Composition: Thin Film; Device Package: 1206 (3216 Metric); Height - Seated (Max): 0.028" (0.70mm); LastUpdated: 2/9/2024 20:53:53; Lifecycle Status: Active; Minimum Order: 1; Number of Terminations: 2; Operating Temperature: -55°C ~ 155°C; Package / Case: 1206 (3216 Metric); Packaging: TapeAndReel; PartId: 40988; Part Status: Active; Price: 0.10; Resistance: 12 kOhms; Series: ERA-8A; Size / Dimension: 0.126" L x 0.063" W (3.20mm x 1.60mm); Supplier 1: DigiKey; Supplier Part Number 1: 10-ERA-8AEB123VCT-ND; Supplier Device Package: 1206; Tolerance: ±0.1%; Value: 12 kOhms; Features: Automotive AEC-Q200; Ratings: AEC-Q200
R62 R72 = RT1206FRE072K2L: Resistor; Manufacturer_Name: YAGEO; Datasheet Link: https://www.mouser.com/datasheet/2/447/PYu_RT_1_to_0_01_RoHS_L_12-3003070.pdf; Height: 0.65mm; Manufacturer_Part_Number: RT1206FRE072K2L; Mouser Part Number: 603-RT1206FRE072K2L; Mouser Price/Stock: https://www.mouser.co.uk/ProductDetail/YAGEO/RT1206FRE072K2L?qs=yNCrj0CQcyJif6VASMbdeQ%3D%3D; Arrow Part Number: RT1206FRE072K2L; Arrow Price/Stock: https://www.arrow.com/en/products/rt1206fre072k2l/yageo?utm_currency=USD&region=nac
R63 R73 = ERJ-8GEYJ510V: as R18 on sheet source_A; Part Number: ERJ-8GEYJ510V; ComponentLink1Description: Datasheet; ComponentLink1URL: http://industrial.panasonic.com/www-cgi/jvcr13pz.cgi?E+PZ+3+AOA0001+ERJ8GEYJ510V+7+WW; ComponentLink2Description: DigiKey Link; ComponentLink2URL: https://www.digikey.com/en/products/detail/panasonic-electronic-components/ERJ-8GEYJ510V/11678; Composition: Thick Film; Device Package: 1206 (3216 Metric); Features: Automotive AEC-Q200; Height - Seated (Max): 0.028" (0.70mm); LastUpdated: 2/9/2024 20:54:16; Lifecycle Status: Active; Minimum Order: 1; Number of Terminations: 2; Operating Temperature: -55°C ~ 155°C; Package / Case: 1206 (3216 Metric); Packaging: TapeAndReel; PartId: 34147; Part Status: Active; Price: 0.02; Ratings: AEC-Q200; Resistance: 51 Ohms; Series: ERJ-8G; Size / Dimension: 0.126" L x 0.063" W (3.20mm x 1.60mm); Supplier 1: DigiKey; Supplier Part Number 1: P51ECT-ND; Supplier Device Package: 1206; Tolerance: ±5%; Value: 51 Ohms
R64 R69 = ERJ-8GEYJ5R1V: as R19 on sheet source_A; Part Number: ERJ-8GEYJ5R1V; ComponentLink1Description: Datasheet; ComponentLink1URL: http://industrial.panasonic.com/www-cgi/jvcr13pz.cgi?E+PZ+3+AOA0001+ERJ8GEYJ5R1V+7+WW; ComponentLink2Description: DigiKey Link; ComponentLink2URL: https://www.digikey.com/en/products/detail/panasonic-electronic-components/ERJ-8GEYJ5R1V/282211; Composition: Thick Film; Device Package: 1206 (3216 Metric); Features: Automotive AEC-Q200; Height - Seated (Max): 0.028" (0.70mm); LastUpdated: 2/9/2024 20:54:09; Lifecycle Status: Active; Minimum Order: 1; Number of Terminations: 2; Operating Temperature: -55°C ~ 155°C; Package / Case: 1206 (3216 Metric); Packaging: TapeAndReel; PartId: 36042; Part Status: Active; Price: 0.02; Ratings: AEC-Q200; Resistance: 5.1 Ohms; Series: ERJ-8G; Size / Dimension: 0.126" L x 0.063" W (3.20mm x 1.60mm); Supplier 1: DigiKey; Supplier Part Number 1: P5.1ECT-ND; Supplier Device Package: 1206; Tolerance: ±5%; Value: 5.1 Ohms
R65 R68 = CSRN2512FKR330: as R20 on sheet source_A; Part Number: CSRN2512FKR330; Package / Case: 2512 (6432 Metric); ComponentLink1Description: Datasheet; ComponentLink1URL: https://www.seielect.com/catalog/sei-csr_csrn.pdf; ComponentLink2Description: DigiKey Link; ComponentLink2URL: https://www.digikey.com/en/products/detail/stackpole-electronics-inc/CSRN2512FKR330/1742756; Composition: Thick Film; Device Package: 2512 (6432 Metric); Features: Current Sense; Height - Seated (Max): 0.028" (0.70mm); LastUpdated: 2/17/2022 18:43:57; Lifecycle Status: Active; Minimum Order: 1; Number of Terminations: 2; Operating Temperature: -55°C ~ 155°C; Packaging: TapeAndReel; PartId: 1770; Part Status: Active; Power (Watts): 2W; Price: 0.12; Resistance: 330 mOhms; Series: CSRN; Size / Dimension: 0.250" L x 0.124" W (6.35mm x 3.15mm); Supplier 1: DigiKey; Supplier Part Number 1: CSRN2512FKR330CT-ND; Supplier Device Package: 2512; Tolerance: ±1%; Value: 330 mOhms
R66 = CSRN2512FKR500: as R21 on sheet source_A; Part Number: CSRN2512FKR500; Package / Case: 2512 (6432 Metric); ComponentLink1Description: Datasheet; ComponentLink1URL: https://www.seielect.com/catalog/sei-csr_csrn.pdf; ComponentLink2Description: DigiKey Link; ComponentLink2URL: https://www.digikey.com/en/products/detail/stackpole-electronics-inc/CSRN2512FKR500/1742768; Composition: Thick Film; Device Package: 2512 (6432 Metric); Features: Current Sense; Height - Seated (Max): 0.028" (0.70mm); LastUpdated: 2/17/2022 18:43:58; Lifecycle Status: Active; Minimum Order: 1; Number of Terminations: 2; Operating Temperature: -55°C ~ 155°C; Packaging: TapeAndReel; PartId: 1683; Part Status: Active; Power (Watts): 2W; Price: 0.07; Resistance: 500 mOhms; Series: CSRN; Size / Dimension: 0.250" L x 0.124" W (6.35mm x 3.15mm); Supplier 1: DigiKey; Supplier Part Number 1: CSRN2512FKR500CT-ND; Supplier Device Package: 2512; Tolerance: ±1%; Value: 500 mOhms
R70 R71 = RT1206FRE073K3L: as R25 on sheet source_A; Part Number: RT1206FRE073K3L; ComponentLink1Description: Datasheet; ComponentLink1URL: https://www.yageo.com/upload/media/product/productsearch/datasheet/rchip/PYu-RT_1-to-0.01_RoHS_L_12.pdf; ComponentLink2Description: DigiKey Link; ComponentLink2URL: https://www.digikey.com/en/products/detail/yageo/RT1206FRE073K3L/1083187; Composition: Thin Film; Device Package: 1206 (3216 Metric); Height - Seated (Max): 0.026" (0.65mm); LastUpdated: 7/25/2024 09:21:22; Lifecycle Status: Active; Minimum Order: 1; Number of Terminations: 2; Operating Temperature: -55°C ~ 155°C; Package / Case: 1206 (3216 Metric); Packaging: TapeAndReel; PartId: 58380; Part Status: Active; Price: 0.01; Resistance: 3.3 kOhms; Series: RT; Size / Dimension: 0.122" L x 0.063" W (3.10mm x 1.60mm); Supplier 1: DigiKey; Supplier Part Number 1: 13-RT1206FRE073K3LCT-ND; Supplier Device Package: 1206; Tolerance: ±1%; Value: 3.3 kOhms
R74 R76 = ERA-8AEB202V: as R29 on sheet source_A; Part Number: ERA-8AEB202V; ComponentLink1Description: Datasheet; ComponentLink1URL: https://industrial.panasonic.com/cdbs/www-data/pdf/RDM0000/AOA0000C307.pdf; ComponentLink2Description: DigiKey Link; ComponentLink2URL: https://www.digikey.com/en/products/detail/panasonic-electronic-components/ERA-8AEB202V/3070866; Composition: Thin Film; Device Package: 1206 (3216 Metric); Features: Automotive AEC-Q200; Height - Seated (Max): 0.028" (0.70mm); LastUpdated: 2/9/2024 20:54:17; Lifecycle Status: Active; Minimum Order: 1; Number of Terminations: 2; Operating Temperature: -55°C ~ 155°C; Package / Case: 1206 (3216 Metric); Packaging: TapeAndReel; PartId: 34011; Part Status: Active; Price: 0.10; Ratings: AEC-Q200; Resistance: 2 kOhms; Series: ERA-8A; Size / Dimension: 0.126" L x 0.063" W (3.20mm x 1.60mm); Supplier 1: DigiKey; Supplier Part Number 1: P2.0KBCCT-ND; Supplier Device Package: 1206; Tolerance: ±0.1%; Value: 2 kOhms
R75 R77 = ERA-8AEB102V: as R30 on sheet source_A; Part Number: ERA-8AEB102V; ComponentLink1Description: Datasheet; ComponentLink1URL: https://industrial.panasonic.com/cdbs/www-data/pdf/RDM0000/AOA0000C307.pdf; ComponentLink2Description: DigiKey Link; ComponentLink2URL: https://www.digikey.com/en/products/detail/panasonic-electronic-components/ERA-8AEB102V/3070741; Composition: Thin Film; Device Package: 1206 (3216 Metric); Features: Automotive AEC-Q200; Height - Seated (Max): 0.028" (0.70mm); LastUpdated: 2/9/2024 20:54:17; Lifecycle Status: Active; Minimum Order: 1; Number of Terminations: 2; Operating Temperature: -55°C ~ 155°C; Package / Case: 1206 (3216 Metric); Packaging: TapeAndReel; PartId: 33986; Part Status: Active; Price: 0.10; Ratings: AEC-Q200; Resistance: 1 kOhms; Series: ERA-8A; Size / Dimension: 0.126" L x 0.063" W (3.20mm x 1.60mm); Supplier 1: DigiKey; Supplier Part Number 1: P1.0KBCCT-ND; Supplier Device Package: 1206; Tolerance: ±0.1%; Value: 1 kOhms
TP7 TP8 = S1751-46R: Test Point; Manufacturer_Name: Harwin; Datasheet Link: https://cdn.harwin.com/pdfs/S1751R.pdf; Height: 2mm; Manufacturer_Part_Number: S1751-46R; Mouser Part Number: 855-S1751-46R; Mouser Price/Stock: https://www.mouser.co.uk/ProductDetail/Harwin/S1751-46R?qs=l6ZPVqNVZb71wETAKrfRig%3D%3D
U6 U7 = TLV9362: as U1 on sheet source_A; ComponentLink1Description: Datasheet; ComponentLink1URL: https://www.ti.com/lit/ds/symlink/tlv9362.pdf
Q6 Q7 = PHPT610030NPKX: ComponentLink1Description: Datasheet; ComponentLink1URL: https://assets.nexperia.com/documents/data-sheet/PHPT610030NPK.pdf; ComponentLink2Description: Supplier; ComponentLink2URL: https://hr.mouser.com/ProductDetail/Nexperia/PHPT610030NPKX?qs=%252BRKXB2WKlSeoXKhT5DAScw%3D%3D

## Sheet misc_B.SchDoc
size 381 x 241 mm; SheetNumber: 6; SheetTotal: 6
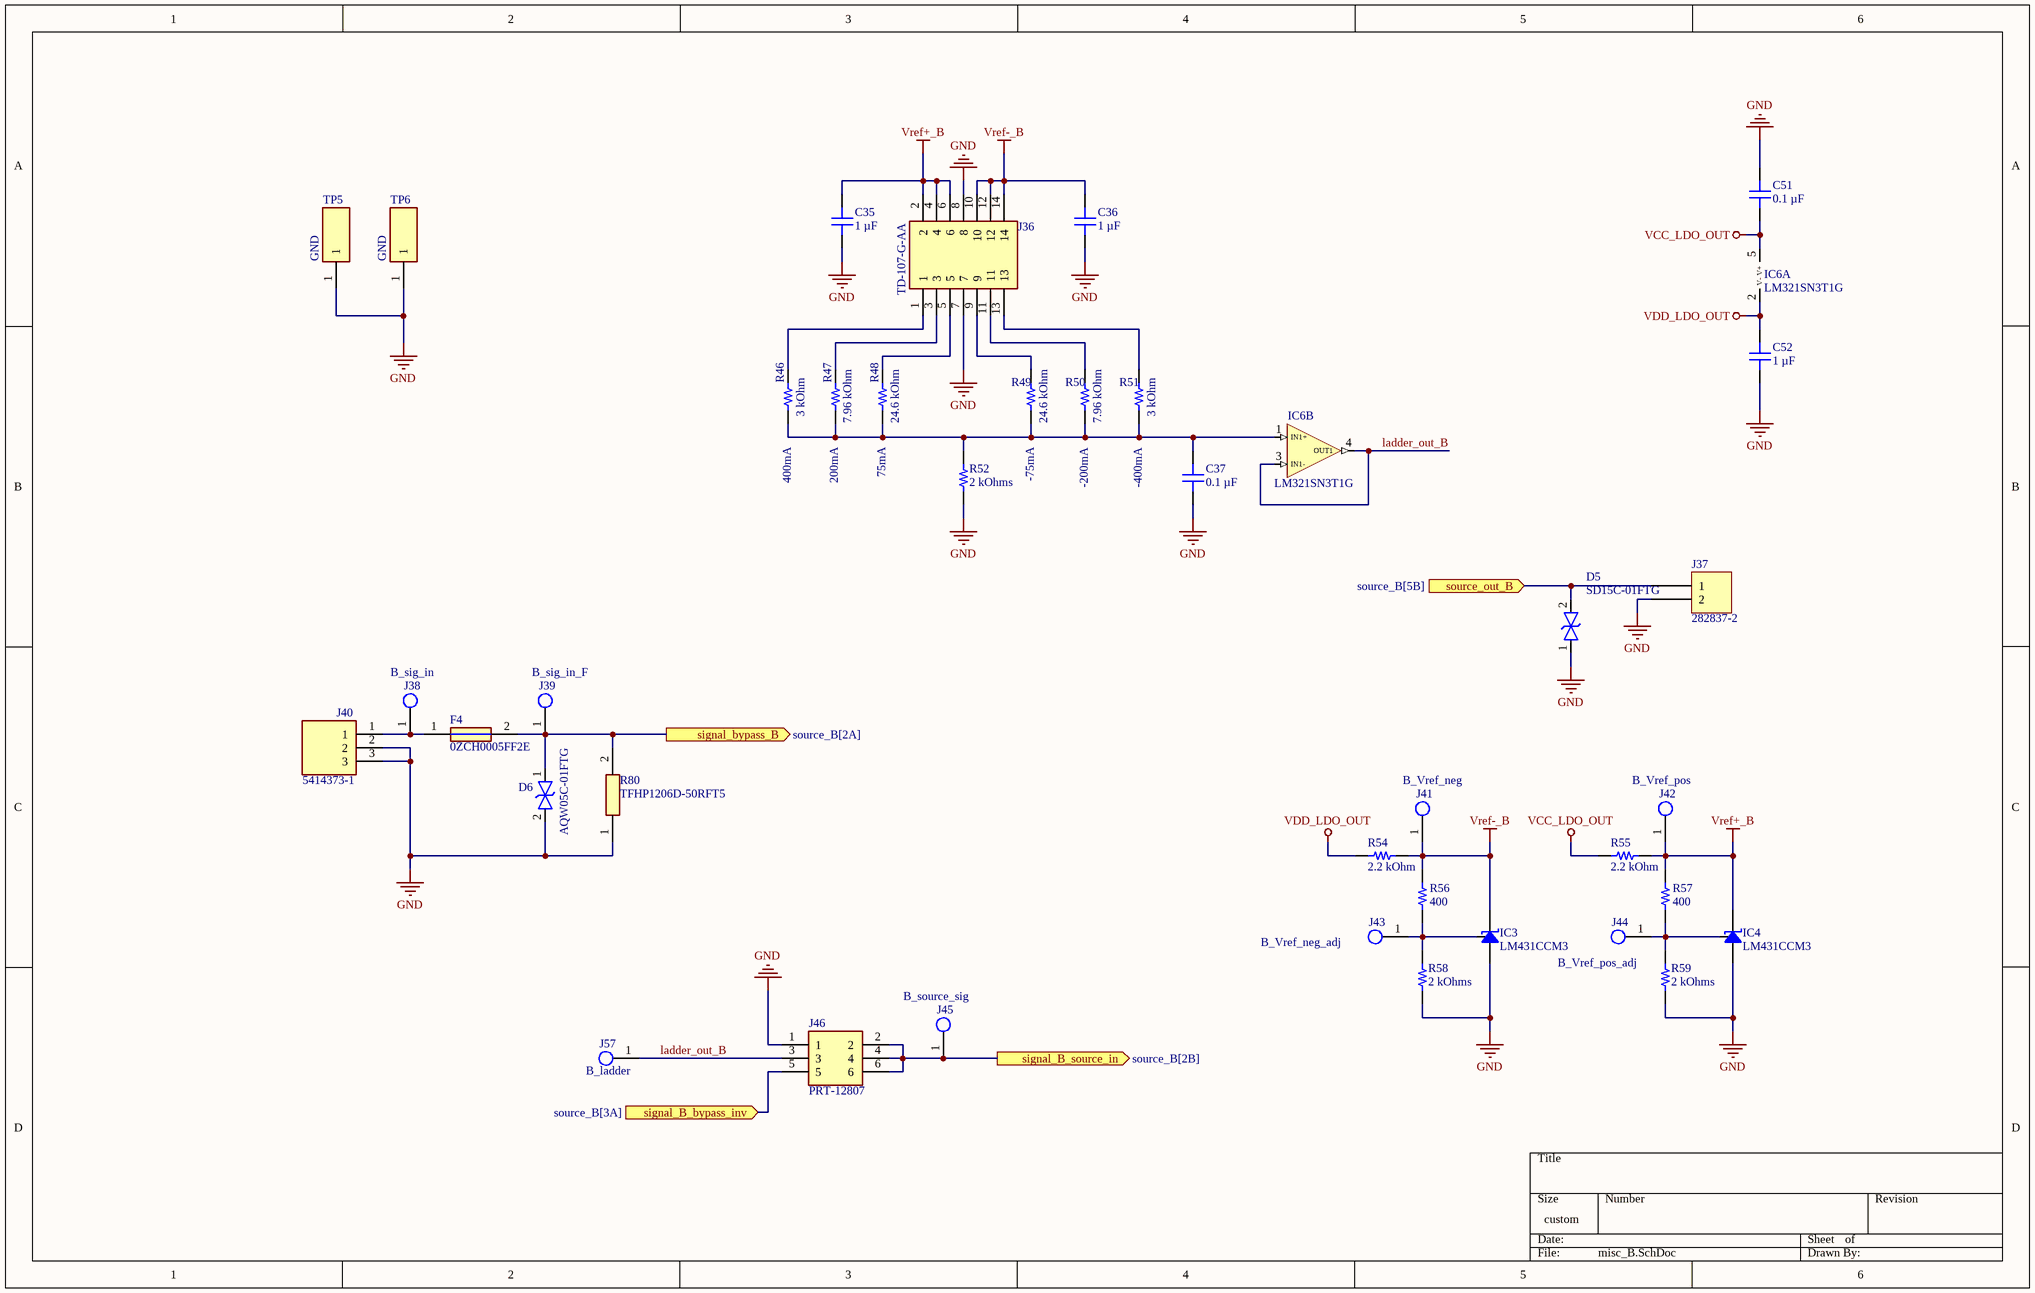
[diagram p5: misc_B.SchDoc]

### Parts
C35  1 µF  [CAP 1206_3216 - 0.8MM]
C36  1 µF  [CAP 1206_3216 - 0.8MM]
C37  0.1 µF  [CAP 1206_3216 - 0.8MM]
C51  0.1 µF  [CAP 1206_3216 - 0.8MM]
C52  1 µF  [CAP 1206_3216 - 0.8MM]
D5  SD15C-01FTG  [SD15C01FTG]
D6  AQW05C-01FTG  [SOD2613X100N]
F4  0ZCH0005FF2E  [FUSC3226X115N]
IC3  LM431CCM3  [SOT96P240X110-3N]
IC4  LM431CCM3  [SOT96P240X110-3N]
IC6  LM321SN3T1G  [SOT95P275X110-5N]  (parts A,B of 2)
J36  TD-107-G-AA  [HDRV14W46P254_2X7_1778X508X818P]
J37  282837-2  [TE 282837-2]
J38  B_sig_in  [FP-5001-MFG]
J39  B_sig_in_F  [FP-5001-MFG]
J40  5414373-1  [54143731]
J41  B_Vref_neg  [FP-5001-MFG]
J42  B_Vref_pos  [FP-5001-MFG]
J43  B_Vref_neg_adj  [FP-5001-MFG]
J44  B_Vref_pos_adj  [FP-5001-MFG]
J45  B_source_sig  [FP-5001-MFG]
J46  PRT-12807  [HDRV6W82P254_2X3_762X500X884P]
J57  B_ladder  [FP-5001-MFG]
R46  3 kOhm  [ERA3AEB101V]
R47  7.96 kOhm  [ERA3AEB101V]
R48  24.6 kOhm  [ERA3AEB101V]
R49  24.6 kOhm  [ERA3AEB101V]
R50  7.96 kOhm  [ERA3AEB101V]
R51  3 kOhm  [ERA3AEB101V]
R52  2 kOhms  [RES 1206_3216]
R54  2.2 kOhm  [RESC3116X65N]
R55  2.2 kOhm  [RESC3116X65N]
R56  400  [RESC3116X65N]
R57  400  [RESC3116X65N]
R58  2 kOhms  [RES 1206_3216]
R59  2 kOhms  [RES 1206_3216]
R80  TFHP1206D-50RFT5  [RESC3016X58N]
TP5  GND  [S175146R]
TP6  GND  [S175146R]

### Ports
signal_B_bypass_inv (in, see source_B[3A]), signal_B_source_in (out, see source_B[2B]), signal_bypass_B (out, see source_B[2A]), source_out_B (in, see source_B[5B])

### Nets
GND: C35.2 C36.1 C37.2 C51.1 C52.2 D5.1 D6.2 IC3.2(Anode) IC4.2(Anode) J36.7 J36.8 J37.2 J40.2 J40.3 J46.1 R52.1 R58.1 R59.1 R80.1 TP5.1 TP6.1
VCC_LDO_OUT: C51.2 IC6.5(V+) R55.2
VDD_LDO_OUT: C52.1 IC6.2(V-) R54.2
Vref+_B: C35.1 IC4.1(Cathode) J36.2 J36.4 J36.6 J42.1 R55.1 R57.2
Vref-_B: C36.2 IC3.1(Cathode) J36.10 J36.12 J36.14 J41.1 R54.1 R56.2
ladder_out_B: IC6.3(IN1-) IC6.4(OUT1) J46.3 J57.1
NetC37_1: C37.1 IC6.1(IN1+) R46.1 R47.1 R48.1 R49.1 R50.1 R51.1 R52.2
NetD5_2: D5.2 J37.1 ; port source_out_B
NetD6_1: D6.1 F4.2 J39.1 R80.2 ; port signal_bypass_B
NetF4_1: F4.1 J38.1 J40.1
NetIC3_3: IC3.3(Ref) J43.1 R56.1 R58.2
NetIC4_3: IC4.3(Ref) J44.1 R57.1 R59.2
NetJ36_1: J36.1 R46.2
NetJ36_3: J36.3 R47.2
NetJ36_5: J36.5 R48.2
NetJ36_9: J36.9 R49.2
NetJ36_11: J36.11 R50.2
NetJ36_13: J36.13 R51.2
NetJ45_1: J45.1 J46.2 J46.4 J46.6 ; port signal_B_source_in
NetJ46_5: J46.5 ; port signal_B_bypass_inv

### Notes on the sheet
- 400mA
- 200mA
- 75mA
- -75mA
- -200mA
- -400mA

### Library data of the parts
C35 C36 C52 = 885012208093: as C8 on sheet source_A; Part Number: 885012208093; Capacitance: 1 µF; Applications: General Purpose; componentlink1description: Datasheet; componentlink1url: https://katalog.we-online.de/pbs/datasheet/885012208093.pdf; componentlink2description: DigiKey Link; componentlink2url: https://www.digikey.com/en/products/detail/würth-elektronik/885012208093/5453432; Device Package: 1206 (3216 Metric); lastupdated: 6/4/2024 19:10:33; Lifecycle Status: Active; Minimum Order: 1; Mounting Type: Surface Mount, MLCC; Operating Temperature: -55°C ~ 125°C; Package / Case: 1206 (3216 Metric); packaging: TapeAndReel; partid: 39665; Part Status: Active; price: 0.10; series: WCAP-CSGP; Size / Dimension: 0.126" L x 0.063" W (3.20mm x 1.60mm); Supplier 1: DigiKey; Supplier Part Number 1: 732-7577-1-ND; Temperature Coefficient: X7R; Thickness (Max): 0.075" (1.90mm); value: 1 µF; Voltage - Rated: 50V
C37 C51 = 885012208087: as C4 on sheet source_A; Part Number: 885012208087; Capacitance: 0.1 µF; Applications: General Purpose; componentlink1description: Datasheet; componentlink1url: https://katalog.we-online.de/pbs/datasheet/885012208087.pdf; componentlink2description: DigiKey Link; componentlink2url: https://www.digikey.com/en/products/detail/würth-elektronik/885012208087/5453982; Device Package: 1206 (3216 Metric); lastupdated: 6/4/2024 19:10:27; Lifecycle Status: Active; Minimum Order: 1; Mounting Type: Surface Mount, MLCC; Operating Temperature: -55°C ~ 125°C; Package / Case: 1206 (3216 Metric); packaging: TapeAndReel; partid: 20879; Part Status: Active; price: 0.06; series: WCAP-CSGP; Size / Dimension: 0.126" L x 0.063" W (3.20mm x 1.60mm); Supplier 1: DigiKey; Supplier Part Number 1: 732-8127-1-ND; Temperature Coefficient: X7R; Thickness (Max): 0.035" (0.90mm); value: 0.1 µF; Voltage - Rated: 50V
D5 = SD15C-01FTG: TVS Diode (Bi-directional); Manufacturer_Name: LITTELFUSE; Datasheet Link: https://www.arrow.com/en/products/sd15c-01ftg/littelfuse; Height: 1.14mm; Manufacturer_Part_Number: SD15C-01FTG; Mouser Part Number: 576-SD15C-01FTG; Mouser Price/Stock: https://www.mouser.co.uk/ProductDetail/Littelfuse/SD15C-01FTG?qs=4zl93aaztU8pjSvpxpJP6g%3D%3D; Arrow Part Number: SD15C-01FTG; Arrow Price/Stock: https://www.arrow.com/en/products/sd15c-01ftg/littelfuse?region=nac
D6 = AQW05C-01FTG: TVS Diode (Bi-directional); Manufacturer_Name: LITTELFUSE; Datasheet Link: https://www.littelfuse.com/media?resourcetype=datasheets&itemid=80ae0bbb-a157-46a1-97eb-84c82c82e9e5&filename=littelfuse-tvs-diode-array-aqw05c-01ftg-datasheet; Height: 1mm; Manufacturer_Part_Number: AQW05C-01FTG; Mouser Part Number: 576-AQW05C-01FTG; Mouser Price/Stock: https://www.mouser.co.uk/ProductDetail/Littelfuse/AQW05C-01FTG?qs=Z%252BL2brAPG1JHH8XKoKQPyw%3D%3D
F4 = 0ZCH0005FF2E: Fuse; Manufacturer_Name: Bel; Datasheet Link: https://www.belfuse.com/resources/datasheets/circuitprotection/ds-cp-0zch-series.pdf; Height: 1.15mm; Manufacturer_Part_Number: 0ZCH0005FF2E; Mouser Part Number: 530-0ZCH0005FF2E
IC3 IC4 = LM431CCM3/NOPB: Integrated Circuit; Manufacturer_Name: Texas Instruments; Datasheet Link: http://www.ti.com/lit/gpn/lm431; Height: 1.12mm; Manufacturer_Part_Number: LM431CCM3/NOPB; Mouser Part Number: 926-LM431CCM3/NOPB; Mouser Price/Stock: https://www.mouser.co.uk/ProductDetail/Texas-Instruments/LM431CCM3-NOPB?qs=QbsRYf82W3GICygfDXnqiw%3D%3D; Arrow Part Number: LM431CCM3/NOPB; Arrow Price/Stock: https://www.arrow.com/en/products/lm431ccm3nopb/texas-instruments?utm_currency=USD&region=nac
IC6 = LM321SN3T1G: Integrated Circuit; Manufacturer_Name: onsemi; Datasheet Link: https://www.onsemi.com/pub/Collateral/LM321-D.PDF; Height: 1.1mm; Manufacturer_Part_Number: LM321SN3T1G; Mouser Part Number: 863-LM321SN3T1G; Mouser Price/Stock: https://www.mouser.co.uk/ProductDetail/onsemi/LM321SN3T1G?qs=slMPpRTKD5qNVsCzBsHVZA%3D%3D; Arrow Part Number: LM321SN3T1G; Arrow Price/Stock: https://www.arrow.com/en/products/lm321sn3t1g/on-semiconductor?utm_currency=USD&region=nac
J36 = TD-107-G-AA: Connector; Manufacturer_Name: SAMTEC; Datasheet Link: https://suddendocs.samtec.com/catalog_english/td.pdf?_gl=1*1wt4qt0*_ga*MTEzMjQwMzYxOS4xNjk3ODEzMDcx*_ga_3KFNZC07WW*MTcxMjgzNDUyOC40My4xLjE3MTI4MzQ1ODguNjAuMC4w; Height: 8.18mm; Manufacturer_Part_Number: TD-107-G-AA; Mouser Part Number: 200-TD107GAA; Mouser Price/Stock: https://www.mouser.co.uk/ProductDetail/Samtec/TD-107-G-AA?qs=0lQeLiL1qybxLJvA9lDIZA%3D%3D; Arrow Part Number: TD-107-G-AA; Arrow Price/Stock: https://www.arrow.com/en/products/td-107-g-aa/samtec
J37 = 282837-2: TERM BLK 2P SIDE ENT 5.08MM PCB; Manufacturer: TE Connectivity AMP Connectors; Current: 13.5 A; Mating Orientation: Horizontal with Board; Number of Levels: 1; Pitch: 0.200" (5.08mm); Positions Per Level: 2; Voltage: 300 V; Wire Gauge: 16-28 AWG; Wire Termination: Screw - Rising Cage Clamp; Part Number: 282837-2; Color: Green; ComponentLink1Description: Datasheet; ComponentLink1URL: https://www.te.com/commerce/DocumentDelivery/DDEController?Action=srchrtrv&DocNm=282837&DocType=Customer+Drawing&DocLang=English; ComponentLink2Description: DigiKey Link; ComponentLink2URL: https://www.digikey.com/en/products/detail/te-connectivity-amp-connectors/282837-2/2187973; Features: Interlocking (Side); LastUpdated: 6/21/2022 15:00:23; Lifecycle Status: Active; Minimum Order: 1; Mounting Type: Through Hole; Packaging: Tray; Part Status: Active; Price: 0.31; Series: Buchanan; Supplier 1: DigiKey; Supplier Part Number 1: A113320-ND
J38 J39 J41-J45 J57 = 5001: as J12 on sheet source_A; Insulation Material: Nylon; Mount: Through Hole; RoHS Compliant: Yes; Series: THM; Height: 0.3inch; Termination: Through Hole; Material: Nylon; Packaging: Bulk; Contact Material: Bronze; REACH SVHC: No SVHC; Contact Plating: Silver; Orientation: Straight; Lead Free: Lead Free; Package Quantity: 100; Length: 7.62mm; Flammability Rating: UL94 V-0; Number of Contacts: 1; Diameter: 2.54mm; Housing Color: Black; Color: Black; Supplier 1: Mouser; Supplier Part Number 1: 534-5001
J40 = 5414373-1: Connector; Manufacturer_Name: TE Connectivity; Datasheet Link: https://www.te.com/commerce/DocumentDelivery/DDEController?Action=srchrtrv&DocNm=1307191_BNC_Connectors&DocType=Catalog%20Section&DocLang=English&PartCntxt=5414373-1&DocFormat=pdf; Height: 8.64mm; Manufacturer_Part_Number: 5414373-1; Mouser Part Number: 571-5414373-1; Mouser Price/Stock: https://www.mouser.co.uk/ProductDetail/TE-Connectivity/5414373-1?qs=TEPVm9Ho6Ekg6JV7ffLu5g%3D%3D; Arrow Part Number: 5414373-1; Arrow Price/Stock: https://www.arrow.com/en/products/5414373-1/te-connectivity?utm_currency=USD&region=nac
J46 = PRT-12807: Connector; Manufacturer_Name: SparkFun; Datasheet Link: https://cdn.sparkfun.com/datasheets/Prototyping/00989.pdf; Height: 8.84mm; Manufacturer_Part_Number: PRT-12807; Mouser Part Number: 474-PRT-12807; Mouser Price/Stock: https://www.mouser.co.uk/ProductDetail/SparkFun/PRT-12807?qs=WyAARYrbSnYnpz4kKzOm4A%3D%3D; Arrow Part Number: PRT-12807; Arrow Price/Stock: https://www.arrow.com/en/products/prt-12807/sparkfun-electronics
R46 R51 = ERA-3AEB302V: Resistor; Manufacturer_Name: Panasonic; Datasheet Link: https://industrial.panasonic.com/cdbs/www-data/pdf/RDM0000/AOA0000C307.pdf; Height: 0.55mm; Manufacturer_Part_Number: ERA-3AEB302V; Mouser Part Number: 667-ERA-3AEB302V; Mouser Price/Stock: https://www.mouser.co.uk/ProductDetail/Panasonic/ERA-3AEB302V?qs=NcBTt3PsE6X1AHNczabKdw%3D%3D; Arrow Part Number: ERA-3AEB302V; Arrow Price/Stock: https://www.arrow.com/en/products/era-3aeb302v/panasonic?utm_currency=USD&region=nac
R47 R50 = TNPW06037K96BEEA: Resistor; Manufacturer_Name: Panasonic; Manufacturer_Part_Number: ERA-3AEB302V; Datasheet Link: https://industrial.panasonic.com/cdbs/www-data/pdf/RDM0000/AOA0000C307.pdf; Height: 0.55mm; Mouser Part Number: 667-ERA-3AEB302V; Mouser Price/Stock: https://www.mouser.co.uk/ProductDetail/Panasonic/ERA-3AEB302V?qs=NcBTt3PsE6X1AHNczabKdw%3D%3D; Arrow Part Number: ERA-3AEB302V; Arrow Price/Stock: https://www.arrow.com/en/products/era-3aeb302v/panasonic?utm_currency=USD&region=nac
R48 R49 = RT0603BRD0724K6L: Resistor; Manufacturer_Name: Panasonic; Manufacturer_Part_Number: ERA-3AEB302V; Datasheet Link: https://industrial.panasonic.com/cdbs/www-data/pdf/RDM0000/AOA0000C307.pdf; Height: 0.55mm; Mouser Part Number: 667-ERA-3AEB302V; Mouser Price/Stock: https://www.mouser.co.uk/ProductDetail/Panasonic/ERA-3AEB302V?qs=NcBTt3PsE6X1AHNczabKdw%3D%3D; Arrow Part Number: ERA-3AEB302V; Arrow Price/Stock: https://www.arrow.com/en/products/era-3aeb302v/panasonic?utm_currency=USD&region=nac
R52 R58 R59 = ERA-8AEB202V: as R29 on sheet source_A; Part Number: ERA-8AEB202V; ComponentLink1Description: Datasheet; ComponentLink1URL: https://industrial.panasonic.com/cdbs/www-data/pdf/RDM0000/AOA0000C307.pdf; ComponentLink2Description: DigiKey Link; ComponentLink2URL: https://www.digikey.com/en/products/detail/panasonic-electronic-components/ERA-8AEB202V/3070866; Composition: Thin Film; Device Package: 1206 (3216 Metric); Features: Automotive AEC-Q200; Height - Seated (Max): 0.028" (0.70mm); LastUpdated: 2/9/2024 20:54:17; Lifecycle Status: Active; Minimum Order: 1; Number of Terminations: 2; Operating Temperature: -55°C ~ 155°C; Package / Case: 1206 (3216 Metric); Packaging: TapeAndReel; PartId: 34011; Part Status: Active; Price: 0.10; Ratings: AEC-Q200; Resistance: 2 kOhms; Series: ERA-8A; Size / Dimension: 0.126" L x 0.063" W (3.20mm x 1.60mm); Supplier 1: DigiKey; Supplier Part Number 1: P2.0KBCCT-ND; Supplier Device Package: 1206; Tolerance: ±0.1%; Value: 2 kOhms
R54 R55 = RT1206FRE072K2L: Resistor; Manufacturer_Name: YAGEO; Datasheet Link: https://www.mouser.com/datasheet/2/447/PYu_RT_1_to_0_01_RoHS_L_12-3003070.pdf; Height: 0.65mm; Manufacturer_Part_Number: RT1206FRE072K2L; Mouser Part Number: 603-RT1206FRE072K2L; Mouser Price/Stock: https://www.mouser.co.uk/ProductDetail/YAGEO/RT1206FRE072K2L?qs=yNCrj0CQcyJif6VASMbdeQ%3D%3D; Arrow Part Number: RT1206FRE072K2L; Arrow Price/Stock: https://www.arrow.com/en/products/rt1206fre072k2l/yageo?utm_currency=USD&region=nac
R56 R57 = RT1206BRD07400RL: Resistor; Manufacturer_Name: YAGEO; Datasheet Link: https://www.mouser.fr/datasheet/2/447/PYu_RT_1_to_0_01_RoHS_L_15-3461507.pdf; Height: 0.65mm; Manufacturer_Part_Number: RT1206BRD07400RL; Mouser Part Number: 603-RT1206BRD07400RL; Mouser Price/Stock: https://www.mouser.co.uk/ProductDetail/YAGEO/RT1206BRD07400RL?qs=NgbZBzc1CyGp8d%2FABgImbQ%3D%3D; Arrow Part Number: RT1206BRD07400RL; Arrow Price/Stock: null?region=nac
R80 = TFHP1206D-50RFT5: Resistor; Manufacturer_Name: TT Electronics; Datasheet Link: https://www.ttelectronics.com/TTElectronics/media/ProductFiles/Datasheet/TFHP.pdf; Height: 0.58mm; Manufacturer_Part_Number: TFHP1206D-50RFT5; Mouser Part Number: 756-TFHP1206B-50RFT5; Mouser Price/Stock: https://www.mouser.co.uk/ProductDetail/Welwyn-Components-TT-Electronics/TFHP1206D-50RFT5?qs=amGC7iS6iy%252ByF%2Fp2IEHb1w%3D%3D
TP5 TP6 = S1751-46R: Test Point; Manufacturer_Name: Harwin; Datasheet Link: https://cdn.harwin.com/pdfs/S1751R.pdf; Height: 2mm; Manufacturer_Part_Number: S1751-46R; Mouser Part Number: 855-S1751-46R; Mouser Price/Stock: https://www.mouser.co.uk/ProductDetail/Harwin/S1751-46R?qs=l6ZPVqNVZb71wETAKrfRig%3D%3D